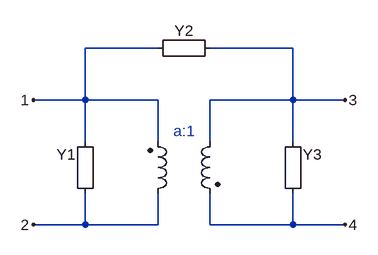
[diagram p0: schematic trafo_z_par_dibujo.asc]
trafo_z_par_dibujo.asc, the LTspice schematic file:
Version 4
SHEET 1 880 1328
WIRE 304 -48 192 -48
WIRE 512 -48 384 -48
WIRE 192 32 192 -48
WIRE 192 32 112 32
WIRE 304 32 192 32
WIRE 512 32 512 -48
WIRE 512 32 384 32
WIRE 592 32 512 32
WIRE 192 96 192 32
WIRE 304 96 304 32
WIRE 384 96 384 32
WIRE 512 96 512 32
WIRE 192 224 192 176
WIRE 192 224 112 224
WIRE 304 224 304 176
WIRE 304 224 192 224
WIRE 384 224 384 176
WIRE 512 224 512 176
WIRE 512 224 384 224
WIRE 592 224 512 224
FLAG 592 32 3
FLAG 592 224 4
FLAG 112 32 1
FLAG 112 224 2
SYMBOL Misc\\EuropeanResistor 400 -64 R90
WINDOW 0 5 56 VBottom 2
WINDOW 3 27 56 Invisible 2
SYMATTR InstName Y2
SYMATTR Value 2
SYMBOL Misc\\EuropeanResistor 208 192 R180
WINDOW 0 31 76 Left 2
WINDOW 3 31 40 Invisible 2
SYMATTR InstName Y1
SYMATTR Value 1
SYMBOL Misc\\EuropeanResistor 496 192 M180
WINDOW 0 31 76 Left 2
WINDOW 3 31 40 Invisible 2
SYMATTR InstName Y3
SYMATTR Value 3
SYMBOL ind2 288 192 M180
WINDOW 0 -35 72 Invisible 2
WINDOW 3 -24 44 Invisible 2
SYMATTR InstName L1
SYMATTR Value 1
SYMATTR Type ind
SYMBOL ind2 400 80 M0
WINDOW 0 -31 34 Invisible 2
WINDOW 3 -20 67 Invisible 2
SYMATTR InstName L2
SYMATTR Value 1
SYMATTR Type ind
TEXT 328 80 Left 2 ;a:1

The netlist it stands for:
* trafo_z_par_dibujo.asc
R§Y2 3 1 2
R§Y1 2 1 1
R§Y3 4 3 3
L1 2 1 1
L2 3 4 1
* a:1
.backanno
.end